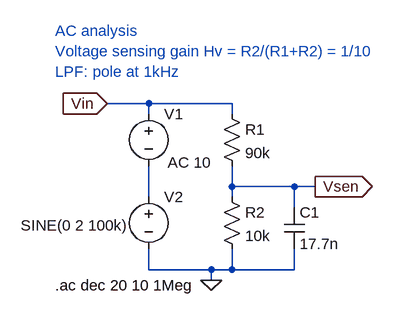
[diagram p0: schematic LTspice 04-3 AC.asc]
LTspice 04-3 AC.asc, the LTspice schematic file:
Version 4
SHEET 1 916 680
WIRE 400 192 336 192
WIRE 528 192 400 192
WIRE 400 208 400 192
WIRE 528 208 528 192
WIRE 528 320 528 288
WIRE 624 320 528 320
WIRE 656 320 624 320
WIRE 400 336 400 288
WIRE 528 336 528 320
WIRE 624 352 624 320
WIRE 400 448 400 416
WIRE 496 448 400 448
WIRE 528 448 528 416
WIRE 528 448 496 448
WIRE 624 448 624 416
WIRE 624 448 528 448
WIRE 496 464 496 448
FLAG 496 464 0
FLAG 656 320 Vsen
IOPIN 656 320 Out
FLAG 336 192 Vin
IOPIN 336 192 In
SYMBOL voltage 400 192 R0
WINDOW 123 29 91 Left 2
WINDOW 39 0 0 Left 2
WINDOW 3 -197 60 Left 2
SYMATTR Value2 AC 10
SYMATTR Value ""
SYMATTR InstName V1
SYMBOL res 512 192 R0
SYMATTR InstName R1
SYMATTR Value 90k
SYMBOL res 512 320 R0
SYMATTR InstName R2
SYMATTR Value 10k
SYMBOL cap 608 352 R0
SYMATTR InstName C1
SYMATTR Value 17.7n
SYMBOL voltage 400 320 R0
WINDOW 123 0 0 Left 2
WINDOW 39 0 0 Left 2
WINDOW 3 -197 60 Left 2
SYMATTR Value SINE(0 2 100k)
SYMATTR InstName V2
TEXT 256 472 Left 2 !.ac dec 20 10 1Meg
TEXT 256 80 Left 2 ;AC analysis\nVoltage sensing gain Hv = R2/(R1+R2) = 1/10\nLPF: pole at 1kHz

The netlist it stands for:
* LTspice 04-3 AC.asc
V1 Vin N001 AC 10
R1 Vin Vsen 90k
R2 Vsen 0 10k
C1 Vsen 0 17.7n
V2 N001 0 SINE(0 2 100k)
.ac dec 20 10 1Meg
* AC analysis
* Voltage sensing gain Hv = R2/(R1+R2) = 1/10
* LPF: pole at 1kHz
.backanno
.end